# EAGLE design IR_Schreib_Lesekopf_TTL_Neu_V1 (EAGLE 7.5.0)
Assembly variants: <unbenannt>
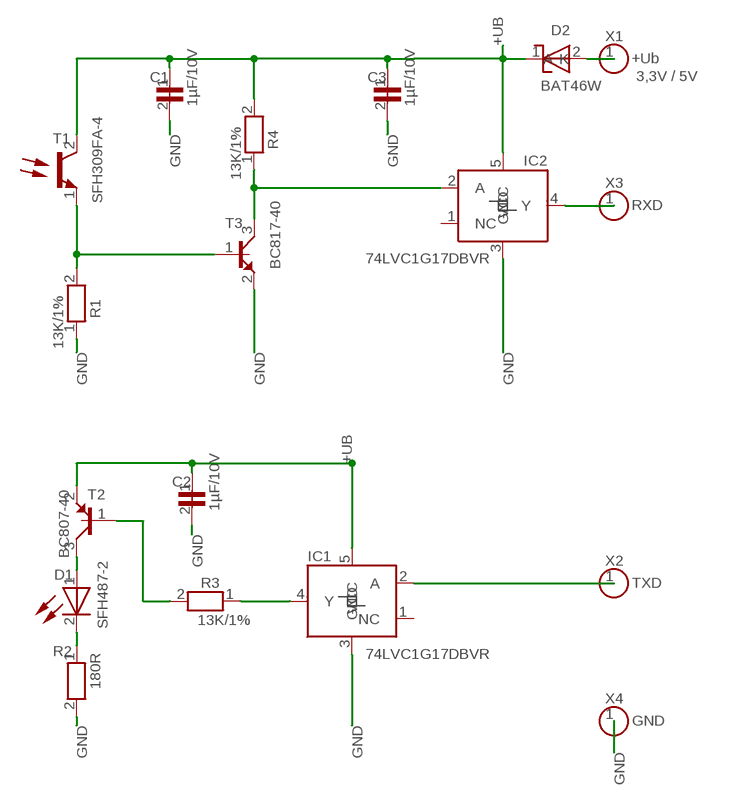
[diagram p0: schematic, sheet 1]

## Parts
C1  1µF/10V  [0603]
C2  1µF/10V  [0603]
C3  1µF/10V  [0603]
D1  SFH487-2  [LED_3MM]
D2  BAT46W  [SOD123]
IC1  74LVC1G17DBVR  [SOT23/5]
IC2  74LVC1G17DBVR  [SOT23/5]
R1  13K/1%  [0603]
R2  180R  [0603]
R3  13K/1%  [0603]
R4  13K/1%  [0603]
T1  SFH309FA-4  [LED_3MM]
T2  BC807-40  [SOT23/3]
T3  BC817-40  [SOT23/3]
X1  +Ub  +UB  [LOETPUNKT]
X2  TXD  [LOETPUNKT]
X3  RXD  [LOETPUNKT]
X4  GND  [LOETPUNKT]

## Nets
1: IC1.4(Y) R3.1
+: R1.2 T1.1 T3.1
+UB: C1.1 C2.1 C3.1 D2.1(K) IC1.5(VCC) IC2.5(VCC) R4.2 T1.2 T2.2
A: D2.2(A) X1.1
B: R3.2 T2.1
C: D1.1 T2.3
GND: C1.2 C2.2 C3.2 IC1.3(GND) IC2.3(GND) R1.1 R2.2 T3.2 X4.1
K: D1.2 R2.1
OUT: IC2.2(A) R4.1 T3.3
SIG$4: IC1.2(A) X2.1
SIG$5: IC2.4(Y) X3.1
Unconnected: IC1.1(NC) IC2.1(NC)

## Notes on the sheet
- 3,3V / 5V

## Library data of the parts
C1-C3 = TARGET3001!_V31.8.0.48:1µF/10V: Keramik-Vielschicht-Kondensator 0,1µF, 50V
D1 = TARGET3001!_V31.8.0.48:SFH487-2: Infrarot-Dioden, Kunststoffgehäuse, IR LED, CN304 [880NM]
D2 = TARGET3001!_V31.8.0.48:BAT46W: Schottky-Diode 0,15A/100V
IC1 IC2 = TARGET3001!_V31.8.0.48:74LVC1G17DBVR
R1 R3 R4 = TARGET3001!_V31.8.0.48:13K/1%: Widerstand, allgemein
R2 = TARGET3001!_V31.8.0.48:180R: Widerstand, allgemein
T1 = TARGET3001!_V31.8.0.48:SFH309FA-4: IR-Fototransistoren, SFH... / BP..., IR Fototransistor, SFH 309-4 [3MM, 860NM]
T2 = TARGET3001!_V31.8.0.48:BC807-40: NF-Transistor 45V, 1A
T3 = TARGET3001!_V31.8.0.48:BC817-40: NF-Transistor UCE:45V, ICE:500mA
X1 = TARGET3001!_V31.8.0.48:+UB: Lötpunkt
X2 = TARGET3001!_V31.8.0.48:TXD: Lötpunkt
X3 = TARGET3001!_V31.8.0.48:RXD: Lötpunkt
X4 = TARGET3001!_V31.8.0.48:GND: Lötpunkt

## Board
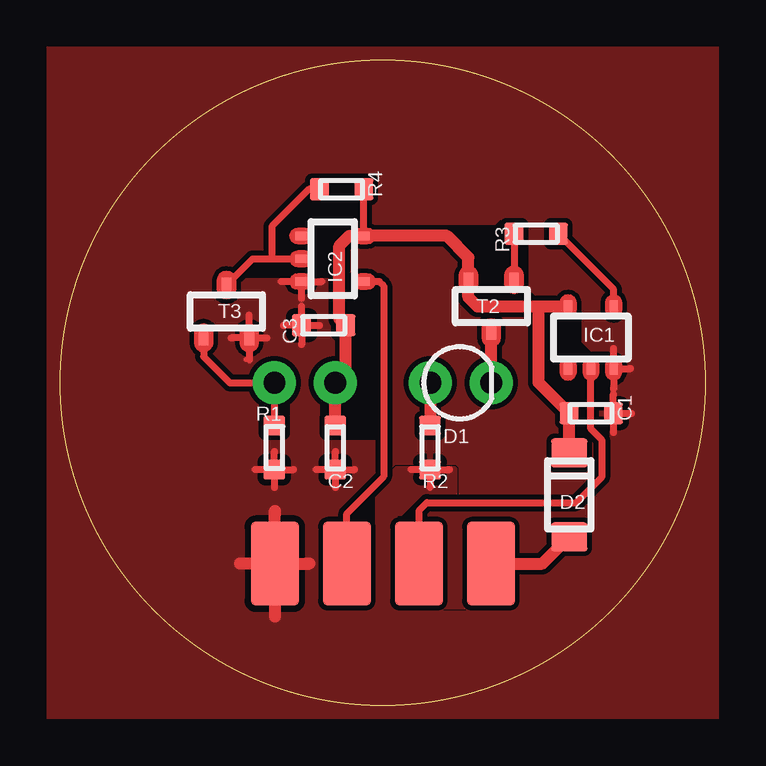
[diagram p1: board, top side]
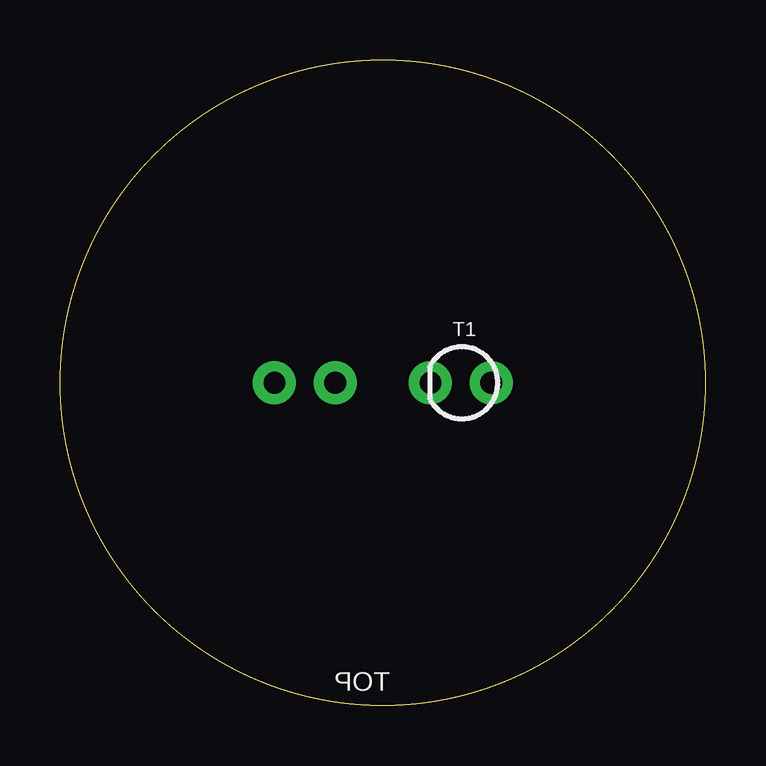
[diagram p2: board, bottom side, seen from below]

Size 26.9 x 26.9 mm. Coordinates in mm from the lower left corner, seen from the top.
Outline: circle at 13.45,13.45 radius 13.45
Copper layers (1*16): Top 0.035mm / dielectric 1.5mm / Bottom 0.035mm
Design rules "TARGET3001!": minimum track width 0.3mm, minimum drill 0.6mm, track to track 0.2mm, track to pad 0.2mm, pad to pad 0.2mm, via to via 0.2mm, smd to smd 0.2mm, copper to edge 0mm, drill to drill 0.3mm, minimum pad ring 0.254mm, minimum via ring 0.2032mm, stop-mask expansion 4mil, vias tented up to drill 0mil, thermal gap 10mil

### Footprints (pad centres in the part's own frame; a part is rotated, then mirrored left to right if it is on the bottom)
0603 = smd 0.8 x 0.9: 1 0.917,0; 2 -0.917,0
LED_3MM = drill 0.9 pad 1.8 round: 1 -1.27,0; 2 1.27,0
SOD123 = smd 1.2 x 1.5: 1 1.75,0; 2 -1.75,0
SOT23/5 = smd 0.35 x 0.5: 1 -0.95,-1.3; 2 0,-1.3; 3 0.95,-1.3; 4 0.95,1.3; 5 -0.95,1.3
SOT23/3 = smd 0.4 x 0.6: 1 -0.95,-1.1; 2 0.95,-1.1; 3 0,1.1
LOETPUNKT = smd 3.5 x 2: 1 0,0

### Placement (x,y rotation side)
C1  22.13,12.18 180 top
C2  11.47,10.75 90 top
C3  10.98,15.84 0 top
D1  16.7,13.45 0 top
D2  21.22,8.78 90 top
IC1  22.12,15.34 0 top
IC2  11.36,18.62 270 top
R1  8.93,10.75 270 top
R2  15.42,10.75 90 top
R3  19.84,19.66 0 top
R4  11.74,21.51 180 top
T1  10.2,13.45 180 bottom
T2  17.97,16.64 180 top
T3  6.93,16.42 0 top
X1  17.95,5.92 90 top
X2  14.95,5.92 270 top
X3  11.95,5.92 90 top
X4  8.95,5.92 270 top

### Tracks (layer width: path | path; a pad name or v marks a point on that pad's centre or on a via)
1
  Top 0.3: IC1.4 23.07,17.34 R3.1
  cutout Top: 16.89,3.96 16.9,3.97 16.91,3.98 16.9,3.99 16.89,3.99 16.01,3.99 16,3.99 15.99,3.98 16,3.97 16.01,3.96
  cutout Top: 16.91,3.97 16.91,3.98 16.91,3.99 16.9,3.99 16.89,3.99 16.89,3.99 16.88,3.98 16.89,3.97 16.89,3.96 16.9,3.97
  cutout Top: 22.17,8.7 22.16,8.71 22.15,8.72 22.14,8.71 22.14,8.7 22.14,7.68 22.14,7.67 22.15,7.66 22.16,7.67 22.17,7.68
  cutout Top: 22.9,11.62 22.9,11.61 22.91,11.61 22.92,11.61 22.92,11.62 22.92,12.6 22.92,12.61 22.91,12.61 22.9,12.61 22.9,12.6
  cutout Top: 22.89,11.62 22.89,11.61 22.89,11.6 22.9,11.6 22.91,11.6 22.92,11.61 22.92,11.62 22.92,11.63 22.91,11.63 22.9,11.63
  cutout Top: 21.97,13.94 21.98,13.93 21.98,13.94 21.99,13.94 21.98,13.95 21.71,14.22 21.7,14.23 21.69,14.22 21.69,14.22 21.69,14.21
  cutout Top: 21.98,13.93 21.99,13.94 21.99,13.94 21.99,13.95 21.98,13.96 21.98,13.96 21.97,13.95 21.96,13.94 21.97,13.94 21.98,13.93
  cutout Top: 21.99,13.92 22,13.92 22.01,13.92 22.01,13.93 22.01,13.94 21.99,13.95 21.98,13.96 21.97,13.95 21.97,13.94 21.97,13.94
  cutout Top: 18.15,20 18.16,20 18.17,20.01 18.16,20.02 18.15,20.02 16.22,20.02 16.21,20.02 16.21,20.01 16.21,20 16.22,20
  cutout Top: 18.37,20.21 18.37,20.22 18.37,20.22 18.36,20.23 18.35,20.22 18.14,20.02 18.14,20.01 18.14,20 18.15,20 18.16,20
  cutout Top: 12.29,22.13 12.3,22.13 12.31,22.14 12.3,22.15 12.29,22.15 11.22,22.15 11.22,22.15 11.21,22.14 11.22,22.13 11.22,22.13
  cutout Top: 12.29,22.12 12.3,22.12 12.31,22.12 12.31,22.13 12.31,22.14 12.3,22.15 12.29,22.15 12.29,22.15 12.28,22.14 12.29,22.13
  cutout Top: 13.22,11.08 13.23,11.08 13.24,11.09 13.23,11.1 13.22,11.1 11.91,11.1 11.91,11.1 11.9,11.09 11.91,11.08 11.91,11.08
  cutout Top: 13.22,11.07 13.23,11.07 13.24,11.07 13.25,11.08 13.24,11.09 13.23,11.1 13.22,11.1 13.22,11.1 13.21,11.09 13.22,11.08
  cutout Top: 11.25,17.82 11.26,17.83 11.26,17.83 11.26,17.84 11.25,17.85 10.67,17.85 10.66,17.84 10.66,17.83 10.66,17.83 10.67,17.82
  cutout Top: 7.74,17.86 7.73,17.85 7.73,17.85 7.73,17.84 7.74,17.83 9.42,17.83 9.43,17.84 9.44,17.85 9.43,17.85 9.42,17.86
  cutout Top: 7.57,17.69 7.57,17.69 7.57,17.68 7.58,17.67 7.59,17.68 7.75,17.84 7.75,17.85 7.75,17.85 7.74,17.86 7.73,17.85
  cutout Top: 13.98,10.01 13.97,10.01 13.97,10 13.97,9.99 13.98,9.98 14.81,9.98 14.82,9.99 14.83,10 14.82,10.01 14.81,10.01
  cutout Top: 13.8,9.84 13.8,9.83 13.8,9.82 13.81,9.82 13.82,9.82 13.99,9.99 13.99,10 13.99,10.01 13.98,10.01 13.97,10.01
  cutout Top: 16.47,10 16.48,10 16.49,10.01 16.48,10.02 16.47,10.02 16.02,10.02 16.01,10.02 16.01,10.01 16.01,10 16.02,10
  cutout Top: 16.58,9.89 16.59,9.88 16.6,9.89 16.6,9.89 16.6,9.9 16.48,10.02 16.47,10.02 16.47,10.02 16.46,10.01 16.47,10
  cutout Top: 16.58,8.81 16.58,8.8 16.59,8.79 16.6,8.8 16.6,8.81 16.6,9.89 16.6,9.9 16.59,9.91 16.58,9.9 16.58,9.89
  cutout Top: 16.39,8.62 16.38,8.61 16.39,8.6 16.4,8.6 16.4,8.6 16.6,8.8 16.6,8.81 16.6,8.81 16.59,8.82 16.58,8.81
  cutout Top: 13.12,8.72 13.11,8.72 13.11,8.73 13.1,8.72 13.09,8.72 13.09,7.57 13.1,7.56 13.11,7.56 13.11,7.56 13.12,7.57
  cutout Top: 14.23,7.89 14.23,7.88 14.23,7.87 14.24,7.87 14.25,7.87 14.75,8.37 14.76,8.38 14.75,8.39 14.74,8.4 14.74,8.39
  cutout Top: 14.09,7.89 14.09,7.89 14.08,7.88 14.09,7.87 14.09,7.87 14.24,7.87 14.25,7.87 14.25,7.88 14.25,7.89 14.24,7.89
  cutout Top: 21.69,15.13 21.69,15.12 21.7,15.11 21.71,15.12 21.71,15.13 21.71,16.61 21.71,16.62 21.7,16.62 21.69,16.62 21.69,16.61
  cutout Top: 22.09,14.72 22.1,14.71 22.11,14.72 22.11,14.72 22.11,14.73 21.71,15.13 21.7,15.14 21.69,15.13 21.69,15.13 21.69,15.12
  cutout Top: 22.85,14.71 22.86,14.72 22.87,14.72 22.86,14.73 22.85,14.74 22.1,14.74 22.09,14.73 22.09,14.72 22.09,14.72 22.1,14.71
  cutout Top: 22.89,14.68 22.89,14.67 22.9,14.68 22.91,14.68 22.9,14.69 22.86,14.73 22.85,14.74 22.85,14.73 22.84,14.72 22.85,14.72
  cutout Top: 19.48,17.34 19.48,17.33 19.49,17.33 19.5,17.33 19.5,17.34 19.5,19.17 19.5,19.18 19.49,19.19 19.48,19.18 19.48,19.17
  cutout Top: 19.76,17.05 19.77,17.05 19.78,17.05 19.78,17.06 19.78,17.07 19.5,17.35 19.49,17.35 19.48,17.35 19.48,17.34 19.48,17.33
  cutout Top: 8.32,12.61 8.32,12.62 8.31,12.62 8.3,12.62 8.29,12.61 8.29,12.07 8.3,12.06 8.31,12.06 8.32,12.06 8.32,12.07
  cutout Top: 8.32,12.61 8.33,12.62 8.32,12.63 8.31,12.63 8.31,12.63 8.3,12.62 8.29,12.61 8.3,12.6 8.31,12.6 8.32,12.6
  cutout Top: 9.57,12.66 9.56,12.67 9.56,12.67 9.55,12.67 9.54,12.66 9.54,12.11 9.55,12.1 9.56,12.1 9.56,12.1 9.57,12.11
  cutout Top: 9.56,12.67 9.55,12.68 9.54,12.67 9.54,12.67 9.54,12.66 9.55,12.65 9.56,12.65 9.56,12.65 9.57,12.66 9.56,12.67
  cutout Top: 10.86,12.61 10.86,12.62 10.85,12.62 10.84,12.62 10.84,12.61 10.84,12.11 10.84,12.1 10.85,12.1 10.86,12.1 10.86,12.11
  cutout Top: 10.81,12.67 10.8,12.67 10.8,12.67 10.79,12.66 10.8,12.65 10.84,12.6 10.85,12.6 10.86,12.6 10.86,12.61 10.86,12.62
  cutout Top: 12.11,12.67 12.1,12.68 12.09,12.69 12.08,12.68 12.08,12.67 12.08,12.1 12.08,12.09 12.09,12.09 12.1,12.09 12.11,12.1
  cutout Top: 12.09,12.69 12.08,12.69 12.08,12.69 12.07,12.68 12.08,12.67 12.08,12.66 12.09,12.66 12.1,12.66 12.11,12.67 12.1,12.68
  cutout Top: 22.88,12.74 22.88,12.73 22.89,12.72 22.9,12.73 22.9,12.74 22.9,13.41 22.9,13.42 22.89,13.42 22.88,13.42 22.88,13.41
  cutout Top: 22.86,12.72 22.85,12.71 22.86,12.7 22.87,12.7 22.88,12.7 22.9,12.73 22.9,12.74 22.9,12.74 22.89,12.75 22.88,12.74
  cutout Top: 22.87,11.11 22.87,11.11 22.88,11.1 22.89,11.11 22.9,11.11 22.9,11.6 22.89,11.61 22.88,11.61 22.87,11.61 22.87,11.6
  cutout Top: 22.85,11.1 22.85,11.09 22.85,11.08 22.86,11.08 22.87,11.08 22.89,11.11 22.9,11.11 22.89,11.12 22.88,11.13 22.87,11.12
+
  Top 0.3: T3.1 5.98,14.54 7.07,13.45 T1.1 R1.2
+UB
  Top 0.3: R4.2 IC2.5 | C2.1
  Top 0.5: C2.1 T1.2 11.9,13.88 C3.1 11.64,16.1 11.64,19.15 12.06,19.57 IC2.5 | IC2.5 16.13,19.57 17.02,18.67 T2.2 17.02,17.01 17.39,16.64 19.94,16.64 | IC2.5 | D2.1 C1.1 | C1.1 | C1.1 19.94,13.46 19.94,16.64 | 19.94,16.64 IC1.5
A
  Top 0.5: X1.1 20.1,5.92 D2.2
B
  Top 0.3: R3.2 T2.1
C
  Top 0.5: 17.97,13.45 T2.3
GND
  Top 0.2: 7.89,14.41 7.74,14.42
  Top 0.3: 23.05,12.98 23.05,12.93 C1.2 | 23.05,11.38 23.05,11.43 C1.2 | 23.8,12.18 23.75,12.18 C1.2 | 12.27,9.83 12.22,9.83 C2.2 | 11.47,10.58 11.47,10.53 C2.2 | 10.67,9.83 10.72,9.83 C2.2 | 11.47,9.08 11.47,9.13 C2.2 | 16.22,9.83 16.17,9.83 R2.2 | 14.62,9.83 14.67,9.83 R2.2 | 15.42,9.08 15.42,9.13 R2.2 | 9.73,9.83 9.68,9.83 R1.1 | 8.93,10.58 8.93,10.53 R1.1 | 8.13,9.83 8.18,9.83 R1.1 | 8.93,9.08 8.93,9.13 R1.1 | 10.82,15.84 10.77,15.84 C3.2 | 10.07,16.64 10.07,16.59 C3.2 | 9.32,15.84 9.37,15.84 C3.2 | 10.07,15.04 10.07,15.09 C3.2 | 8.63,15.32 8.58,15.32 T3.2 | 7.88,16.27 7.88,16.22 T3.2 | 7.13,15.32 7.18,15.32 T3.2 | 10.91,17.67 10.86,17.67 IC2.3 | 9.21,17.67 9.26,17.67 IC2.3 | 10.06,16.97 10.06,17.02 IC2.3 | 23.77,14.04 23.72,14.04 IC1.3 | 23.07,14.89 23.07,14.84 IC1.3 | 23.07,13.19 23.07,13.24 IC1.3 | 7.89,14.41 7.89,14.42 T3.2
  Top 0.5: 10.4,5.92 10.25,5.92 X4.1 | 8.95,8.12 8.95,7.97 X4.1 | 7.5,5.92 7.65,5.92 X4.1 | 8.95,3.72 8.95,3.87 X4.1
  pour Top: 27.44,-0.55 27.44,27.45 -0.56,27.45 -0.56,-0.55
K
  Top 0.3: R2.1
  Top 0.5: 15.43,13.45 R2.1
OUT
  Top 0.3: T3.3 8.03,18.62 8.82,18.62 | R4.1 10.37,21.51 8.82,19.97 8.82,18.62 | 8.82,18.62 IC2.2
SIG$4
  Top 0.3: X2.1 14.95,8.11 15.29,8.45 21.5,8.45 22.56,9.51 22.56,11.08 22.12,11.53 IC1.2
SIG$5
  Top 0.3: X3.1 11.95,8 13.48,9.54 13.48,17.49 13.31,17.67 IC2.4

### Text on the board
bPlace: TOP
Measures: PIC&PLACE 0/0 | 27 | 27